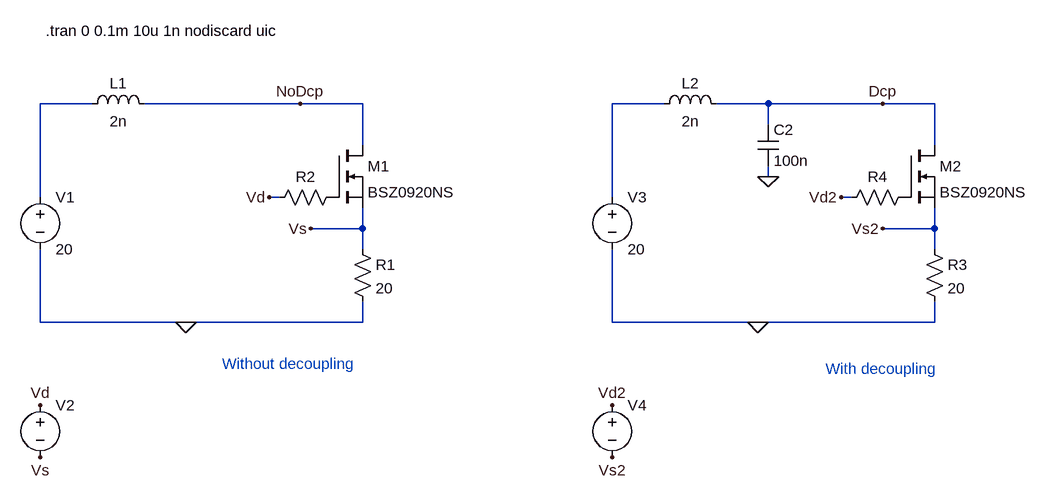
[diagram p0: schematic Decoupling.asc]
Decoupling.asc, the LTspice schematic file:
Version 4
SHEET 1 1724 752
WIRE 288 128 208 128
WIRE 608 128 368 128
WIRE 704 128 608 128
WIRE 1168 128 1088 128
WIRE 1328 128 1248 128
WIRE 1504 128 1328 128
WIRE 1584 128 1504 128
WIRE 1328 160 1328 128
WIRE 704 192 704 128
WIRE 1584 192 1584 128
WIRE 1328 240 1328 224
WIRE 208 272 208 128
WIRE 576 272 560 272
WIRE 1088 272 1088 128
WIRE 1456 272 1440 272
WIRE 704 320 704 288
WIRE 704 320 624 320
WIRE 1584 320 1584 288
WIRE 1584 320 1504 320
WIRE 704 352 704 320
WIRE 1584 352 1584 320
WIRE 208 464 208 352
WIRE 432 464 208 464
WIRE 704 464 704 432
WIRE 704 464 432 464
WIRE 1088 464 1088 352
WIRE 1312 464 1088 464
WIRE 1584 464 1584 432
WIRE 1584 464 1312 464
FLAG 624 320 Vs
FLAG 208 672 Vs
FLAG 560 272 Vd
FLAG 208 592 Vd
FLAG 432 464 0
FLAG 1504 320 Vs2
FLAG 1088 672 Vs2
FLAG 1440 272 Vd2
FLAG 1088 592 Vd2
FLAG 1312 464 0
FLAG 1328 240 0
FLAG 1504 128 Dcp
FLAG 608 128 NoDcp
SYMBOL voltage 208 256 R0
SYMATTR InstName V1
SYMATTR Value 20
SYMBOL voltage 208 576 R0
WINDOW 3 24 96 Invisible 2
SYMATTR InstName V2
SYMATTR Value PULSE(0 15 0 1n 1n 10u 20u)
SYMBOL nmos 656 192 R0
SYMATTR InstName M1
SYMATTR Value BSZ0920NS
SYMBOL res 688 336 R0
SYMATTR InstName R1
SYMATTR Value 20
SYMBOL ind 272 144 R270
WINDOW 0 32 56 VTop 2
WINDOW 3 5 56 VBottom 2
SYMATTR InstName L1
SYMATTR Value 2n
SYMBOL res 672 256 R90
WINDOW 0 0 56 VBottom 2
WINDOW 3 32 56 Invisible 2
SYMATTR InstName R2
SYMATTR Value 10
SYMBOL voltage 1088 256 R0
SYMATTR InstName V3
SYMATTR Value 20
SYMBOL voltage 1088 576 R0
WINDOW 3 24 96 Invisible 2
SYMATTR InstName V4
SYMATTR Value PULSE(0 15 0 1n 1n 10u 20u)
SYMBOL nmos 1536 192 R0
SYMATTR InstName M2
SYMATTR Value BSZ0920NS
SYMBOL res 1568 336 R0
SYMATTR InstName R3
SYMATTR Value 20
SYMBOL ind 1152 144 R270
WINDOW 0 32 56 VTop 2
WINDOW 3 5 56 VBottom 2
SYMATTR InstName L2
SYMATTR Value 2n
SYMBOL res 1552 256 R90
WINDOW 0 0 56 VBottom 2
WINDOW 3 32 56 Invisible 2
SYMATTR InstName R4
SYMATTR Value 10
SYMBOL cap 1312 160 R0
SYMATTR InstName C2
SYMATTR Value 100n
SYMATTR SpiceLine Rser=0.02
TEXT 216 16 Left 2 !.tran 0 0.1m 10u 1n nodiscard uic
TEXT 488 528 Left 2 ;Without decoupling
TEXT 1416 536 Left 2 ;With decoupling

The netlist it stands for:
* Decoupling.asc
V1 N001 0 20
V2 Vd Vs PULSE(0 15 0 1n 1n 10u 20u)
M1 NoDcp P001 Vs Vs BSZ0920NS
R1 Vs 0 20
L1 N001 NoDcp 2n
R2 P001 Vd 10
V3 N002 0 20
V4 Vd2 Vs2 PULSE(0 15 0 1n 1n 10u 20u)
M2 Dcp P002 Vs2 Vs2 BSZ0920NS
R3 Vs2 0 20
L2 N002 Dcp 2n
R4 P002 Vd2 10
C2 Dcp 0 100n Rser=0.02
.model NMOS NMOS
.model PMOS PMOS
.lib standard.mos
.tran 0 0.1m 10u 1n nodiscard uic
* Without decoupling
* With decoupling
.backanno
.end

* Results of the author's LTspice run, read from the files saved beside the schematic
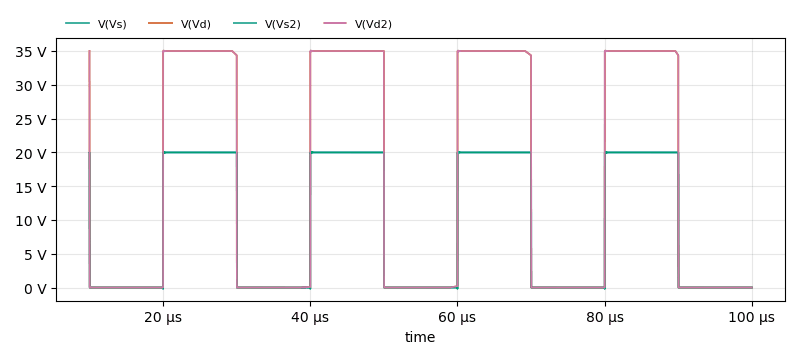
[diagram p1: Transient Analysis of Decoupling.asc, plotted from the saved traces]
* Transient Analysis, 1 run:
*   V(Vs): min -175.2 mV, max 19.99 V, average 8.898 V, rms 13.33 V, last 0 V
*   V(Vd): min 0 V, max 34.99 V, average 15.57 V, rms 23.33 V, last 0 V
*   V(Vs2): min -189.9 mV, max 20.09 V, average 8.898 V, rms 13.33 V, last 0 V
*   V(Vd2): min -13.3 mV, max 35.09 V, average 15.57 V, rms 23.33 V, last 0 V